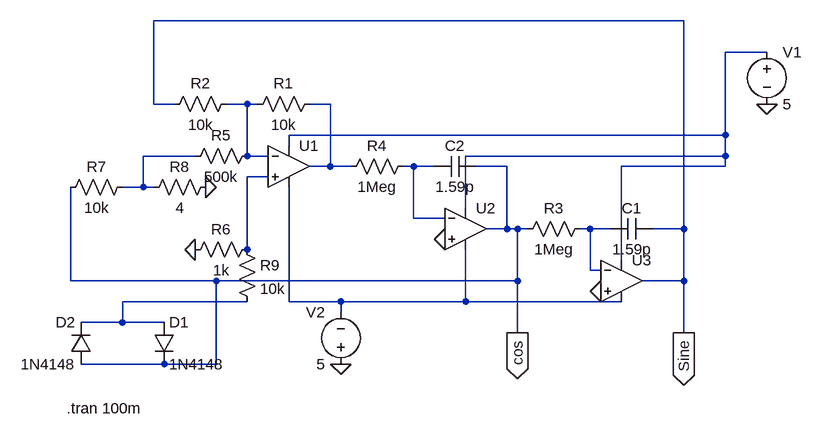
[diagram p0: schematic Quadrature Osc_Art of Electronics.asc]
Quadrature Osc_Art of Electronics.asc, the LTspice schematic file:
Version 4
SHEET 1 880 680
WIRE 544 -128 -272 -128
WIRE 672 -80 608 -80
WIRE -272 0 -272 -128
WIRE -240 0 -272 0
WIRE -128 0 -160 0
WIRE -112 0 -128 0
WIRE 0 0 -32 0
WIRE 608 48 608 -80
WIRE 608 48 -64 48
WIRE -64 64 -64 48
WIRE -208 80 -288 80
WIRE -128 80 -128 0
WIRE -96 80 -128 80
WIRE 608 80 608 48
WIRE 608 80 208 80
WIRE 0 96 0 0
WIRE 0 96 -32 96
WIRE 32 96 0 96
WIRE 128 96 112 96
WIRE 160 96 128 96
WIRE 272 96 224 96
WIRE 608 96 608 80
WIRE 608 96 448 96
WIRE -96 112 -128 112
WIRE -288 128 -288 80
WIRE -288 128 -320 128
WIRE -272 128 -288 128
WIRE 208 160 208 80
WIRE 128 176 128 96
WIRE 176 176 128 176
WIRE 272 192 272 96
WIRE 272 192 240 192
WIRE 288 192 272 192
WIRE 304 192 288 192
WIRE 400 192 384 192
WIRE 432 192 400 192
WIRE 544 192 544 -128
WIRE 544 192 496 192
WIRE -128 224 -128 112
WIRE 448 240 448 96
WIRE 400 256 400 192
WIRE 416 256 400 256
WIRE -400 272 -400 128
WIRE -176 272 -400 272
WIRE 288 272 288 192
WIRE 288 272 -176 272
WIRE 544 272 544 192
WIRE 544 272 480 272
WIRE -128 304 -320 304
WIRE -64 304 -64 128
WIRE 16 304 -64 304
WIRE 208 304 208 224
WIRE 208 304 16 304
WIRE 448 304 208 304
WIRE 16 320 16 304
WIRE -320 336 -320 304
WIRE -320 336 -384 336
WIRE -256 336 -320 336
WIRE 288 352 288 272
WIRE 544 352 544 272
WIRE -256 400 -384 400
WIRE -176 400 -176 272
WIRE -176 400 -256 400
FLAG 544 352 Sine
IOPIN 544 352 Out
FLAG -192 128 0
FLAG -208 224 0
FLAG 416 288 0
FLAG 176 208 0
FLAG 288 352 cos
IOPIN 288 352 Out
FLAG 672 0 0
FLAG 16 400 0
SYMBOL OpAmps\\UniversalOpAmp -64 96 R0
SYMATTR InstName U1
SYMBOL OpAmps\\UniversalOpAmp 208 192 R0
SYMATTR InstName U2
SYMBOL OpAmps\\UniversalOpAmp 448 272 R0
SYMATTR InstName U3
SYMBOL cap 496 176 R90
WINDOW 0 0 32 VBottom 2
WINDOW 3 32 32 VTop 2
SYMATTR InstName C1
SYMATTR Value 1.59p
SYMBOL res 400 176 R90
WINDOW 0 0 56 VBottom 2
WINDOW 3 32 56 VTop 2
SYMATTR InstName R3
SYMATTR Value 1Meg
SYMBOL cap 224 80 R90
WINDOW 0 0 32 VBottom 2
WINDOW 3 32 32 VTop 2
SYMATTR InstName C2
SYMATTR Value 1.59p
SYMBOL res 128 80 R90
WINDOW 0 0 56 VBottom 2
WINDOW 3 32 56 VTop 2
SYMATTR InstName R4
SYMATTR Value 1Meg
SYMBOL res -16 -16 R90
WINDOW 0 0 56 VBottom 2
WINDOW 3 32 56 VTop 2
SYMATTR InstName R1
SYMATTR Value 10k
SYMBOL res -144 -16 R90
WINDOW 0 0 56 VBottom 2
WINDOW 3 32 56 VTop 2
SYMATTR InstName R2
SYMATTR Value 10k
SYMBOL res -112 64 R90
WINDOW 0 0 56 VBottom 2
WINDOW 3 32 56 VTop 2
SYMATTR InstName R5
SYMATTR Value 500k
SYMBOL res -112 208 R90
WINDOW 0 0 56 VBottom 2
WINDOW 3 32 56 VTop 2
SYMATTR InstName R6
SYMATTR Value 1k
SYMBOL res -304 112 R90
WINDOW 0 0 56 VBottom 2
WINDOW 3 32 56 VTop 2
SYMATTR InstName R7
SYMATTR Value 10k
SYMBOL res -176 112 R90
WINDOW 0 0 56 VBottom 2
WINDOW 3 32 56 VTop 2
SYMATTR InstName R8
SYMATTR Value 4
SYMBOL voltage 672 -96 R0
WINDOW 123 0 0 Left 0
WINDOW 39 0 0 Left 0
SYMATTR InstName V1
SYMATTR Value 5
SYMBOL voltage 16 416 R180
WINDOW 0 24 96 Left 2
WINDOW 3 24 16 Left 2
WINDOW 123 0 0 Left 0
WINDOW 39 0 0 Left 0
SYMATTR InstName V2
SYMATTR Value 5
SYMBOL res -144 208 R0
SYMATTR InstName R9
SYMATTR Value 10k
SYMBOL diode -272 336 R0
SYMATTR InstName D1
SYMATTR Value 1N4148
SYMBOL diode -368 400 R180
WINDOW 0 24 64 Left 2
WINDOW 3 24 0 Left 2
SYMATTR InstName D2
SYMATTR Value 1N4148
TEXT -406 468 Left 2 !.tran 100m

The netlist it stands for:
* Quadrature Osc_Art of Electronics.asc
XU1 N006 N002 N001 N009 N003 level1 Avol=1Meg GBW=10Meg Vos=0 En=0 Enk=0 In=0 Ink=0 Rin=500Meg  ; pins In+ In- V+ V- OUT
XU2 0 N005 N001 N009 cos level1 Avol=1Meg GBW=10Meg Vos=0 En=0 Enk=0 In=0 Ink=0 Rin=500Meg  ; pins In+ In- V+ V- OUT
XU3 0 N007 N001 N009 Sine level1 Avol=1Meg GBW=10Meg Vos=0 En=0 Enk=0 In=0 Ink=0 Rin=500Meg  ; pins In+ In- V+ V- OUT
C1 Sine N007 1.59p
R3 N007 cos 1Meg
C2 cos N005 1.59p
R4 N005 N003 1Meg
R1 N003 N002 10k
R2 N002 Sine 10k
R5 N002 N004 500k
R6 N006 0 1k
R7 N004 cos 10k
R8 0 N004 4
V1 N001 0 5
V2 0 N009 5
R9 N006 N008 10k
D1 N008 cos 1N4148
D2 cos N008 1N4148
.model D D
.lib standard.dio
.tran 100m
.lib UniversalOpAmp1.lib
.backanno
.end